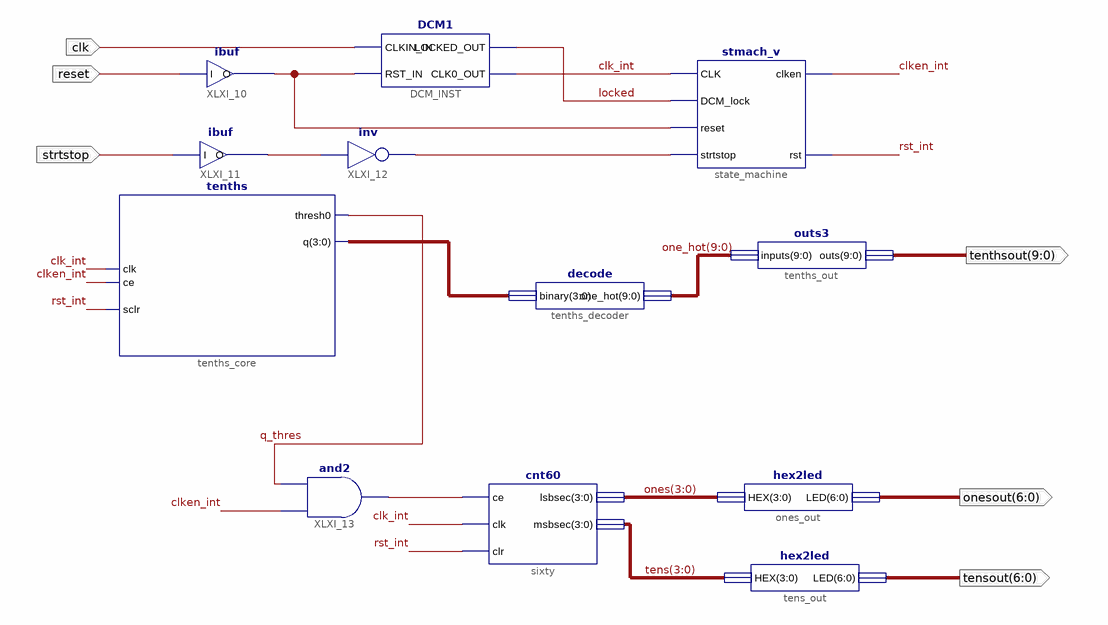
[diagram p0: schematic sheet 1]
// Xilinx ISE schematic stopwatch.sch (spartan3e) as structural Verilog: 12 symbols, 6 ports
module stopwatch (
  input  strtstop,
  input  clk,
  input  reset,
  output [6:0] onesout,
  output [6:0] tensout,
  output [9:0] tenthsout
);

  wire clk_int, clken_int, locked, q_thres, rst_int, XLXN_10, XLXN_11, XLXN_12, XLXN_36;
  wire [3:0] ones, tens, XLXN_43;
  wire [9:0] one_hot;

  DCM1 DCM_INST (.CLKIN_IN(clk), .RST_IN(XLXN_11), .LOCKED_OUT(locked), .CLK0_OUT(clk_int));
  stmach_v state_machine (
    .CLK(clk_int), .DCM_lock(locked), .reset(XLXN_11), .strtstop(XLXN_12), .clken(clken_int), .rst(rst_int));
  ibuf XLXI_11 (.I(strtstop), .O(XLXN_10));
  not XLXI_12 (XLXN_12, XLXN_10);
  tenths tenths_core (.clk(clk_int), .ce(clken_int), .sclr(rst_int), .thresh0(q_thres), .q(XLXN_43));
  hex2led ones_out (.HEX(ones), .LED(onesout));
  hex2led tens_out (.HEX(tens), .LED(tensout));
  and XLXI_13 (XLXN_36, clken_int, q_thres);
  cnt60 sixty (.ce(XLXN_36), .clk(clk_int), .clr(rst_int), .lsbsec(ones), .msbsec(tens));
  decode tenths_decoder (.binary(XLXN_43), .one_hot(one_hot));
  outs3 tenths_out (.inputs(one_hot), .outs(tenthsout));
  ibuf XLXI_10 (.I(reset), .O(XLXN_11));
endmodule
